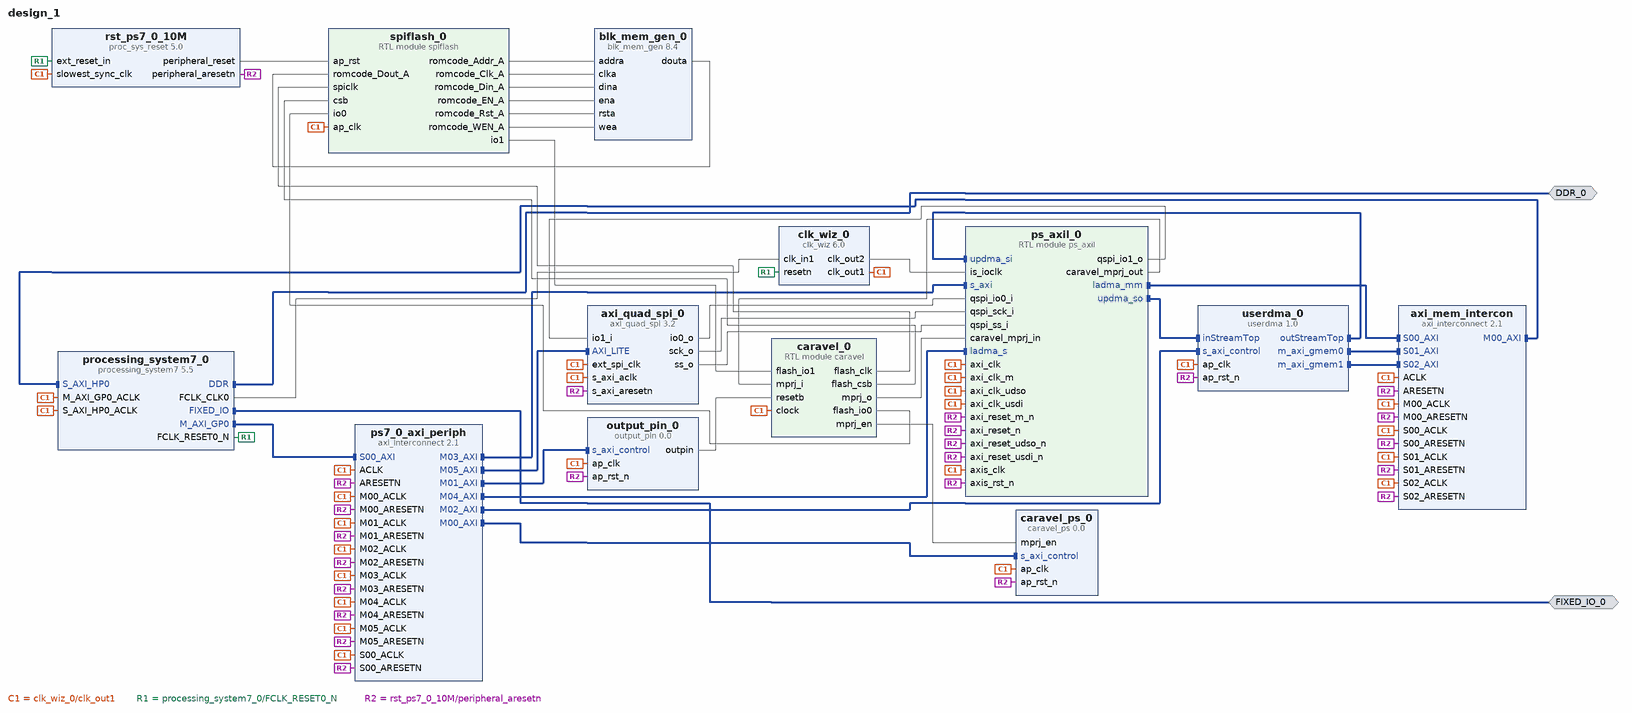
[diagram p0: block diagram of the top level]
# Vivado block design design_1, xc7z020clg400-1, Vivado 2022.1
create_bd_design design_1

create_bd_intf_port -mode Master -vlnv xilinx.com:interface:ddrx_rtl:1.0 DDR_0
create_bd_intf_port -mode Master -vlnv xilinx.com:display_processing_system7:fixedio_rtl:1.0 FIXED_IO_0

create_bd_cell -type ip -vlnv xilinx.com:ip:axi_interconnect:2.1 axi_mem_intercon
set_property -dict {CONFIG.NUM_MI 1 CONFIG.NUM_SI 3} [get_bd_cells axi_mem_intercon]
create_bd_cell -type ip -vlnv xilinx.com:ip:axi_quad_spi:3.2 axi_quad_spi_0
set_property -dict {CONFIG.C_SCK_RATIO 8 CONFIG.C_USE_STARTUP 0} [get_bd_cells axi_quad_spi_0]
create_bd_cell -type ip -vlnv xilinx.com:ip:blk_mem_gen:8.4 blk_mem_gen_0
set_property -dict [list \
  CONFIG.Enable_B Use_ENB_Pin \
  CONFIG.Memory_Type True_Dual_Port_RAM \
  CONFIG.Port_B_Clock 100 \
  CONFIG.Port_B_Enable_Rate 100 \
  CONFIG.Port_B_Write_Rate 50 \
  CONFIG.Use_RSTB_Pin true \
] [get_bd_cells blk_mem_gen_0]
create_bd_cell -type ip -vlnv xilinx.com:hls:caravel_ps:0.0 caravel_ps_0
create_bd_cell -type ip -vlnv xilinx.com:ip:clk_wiz:6.0 clk_wiz_0
set_property -dict [list \
  CONFIG.CLKIN1_JITTER_PS 40.0 \
  CONFIG.CLKOUT1_JITTER 925.151 \
  CONFIG.CLKOUT1_PHASE_ERROR 919.522 \
  CONFIG.CLKOUT1_REQUESTED_OUT_FREQ 5 \
  CONFIG.CLKOUT2_JITTER 761.006 \
  CONFIG.CLKOUT2_PHASE_ERROR 919.522 \
  CONFIG.CLKOUT2_REQUESTED_OUT_FREQ 20 \
  CONFIG.CLKOUT2_USED true \
  CONFIG.MMCM_CLKFBOUT_MULT_F 64.000 \
  CONFIG.MMCM_CLKIN1_PERIOD 4.000 \
  CONFIG.MMCM_CLKIN2_PERIOD 10.0 \
  CONFIG.MMCM_CLKOUT0_DIVIDE_F 128.000 \
  CONFIG.MMCM_CLKOUT1_DIVIDE 32 \
  CONFIG.MMCM_DIVCLK_DIVIDE 25 \
  CONFIG.NUM_OUT_CLKS 2 \
  CONFIG.RESET_PORT resetn \
  CONFIG.RESET_TYPE ACTIVE_LOW \
] [get_bd_cells clk_wiz_0]
create_bd_cell -type ip -vlnv xilinx.com:hls:output_pin:0.0 output_pin_0
create_bd_cell -type ip -vlnv xilinx.com:ip:processing_system7:5.5 processing_system7_0
set_property -dict [list \
  CONFIG.PCW_APU_PERIPHERAL_FREQMHZ 650 \
  CONFIG.PCW_CRYSTAL_PERIPHERAL_FREQMHZ 50 \
  CONFIG.PCW_ENET0_ENET0_IO {MIO 16 .. 27} \
  CONFIG.PCW_ENET0_GRP_MDIO_ENABLE 1 \
  CONFIG.PCW_ENET0_GRP_MDIO_IO {MIO 52 .. 53} \
  CONFIG.PCW_ENET0_PERIPHERAL_ENABLE 1 \
  CONFIG.PCW_ENET0_RESET_ENABLE 1 \
  CONFIG.PCW_ENET0_RESET_IO {MIO 9} \
  CONFIG.PCW_ENET_RESET_ENABLE 1 \
  CONFIG.PCW_ENET_RESET_SELECT {Share reset pin} \
  CONFIG.PCW_FPGA0_PERIPHERAL_FREQMHZ 250 \
  CONFIG.PCW_FPGA1_PERIPHERAL_FREQMHZ 50 \
  CONFIG.PCW_GPIO_MIO_GPIO_ENABLE 1 \
  CONFIG.PCW_GPIO_MIO_GPIO_IO MIO \
  CONFIG.PCW_I2C_RESET_ENABLE 0 \
  CONFIG.PCW_PERIPHERAL_BOARD_PRESET part0 \
  CONFIG.PCW_PRESET_BANK1_VOLTAGE {LVCMOS 1.8V} \
  CONFIG.PCW_QSPI_GRP_FBCLK_ENABLE 1 \
  CONFIG.PCW_QSPI_GRP_FBCLK_IO {MIO 8} \
  CONFIG.PCW_QSPI_GRP_SINGLE_SS_ENABLE 1 \
  CONFIG.PCW_QSPI_GRP_SINGLE_SS_IO {MIO 1 .. 6} \
  CONFIG.PCW_QSPI_PERIPHERAL_ENABLE 1 \
  CONFIG.PCW_QSPI_QSPI_IO {MIO 1 .. 6} \
  CONFIG.PCW_SD0_GRP_CD_ENABLE 1 \
  CONFIG.PCW_SD0_GRP_CD_IO {MIO 47} \
  CONFIG.PCW_SD0_GRP_WP_ENABLE 0 \
  CONFIG.PCW_SD0_PERIPHERAL_ENABLE 1 \
  CONFIG.PCW_SD0_SD0_IO {MIO 40 .. 45} \
  CONFIG.PCW_SDIO_PERIPHERAL_FREQMHZ 50 \
  CONFIG.PCW_SINGLE_QSPI_DATA_MODE x4 \
  CONFIG.PCW_UART0_PERIPHERAL_ENABLE 1 \
  CONFIG.PCW_UART0_UART0_IO {MIO 14 .. 15} \
  CONFIG.PCW_UART1_PERIPHERAL_ENABLE 0 \
  CONFIG.PCW_UART_PERIPHERAL_FREQMHZ 100 \
  CONFIG.PCW_UIPARAM_DDR_BUS_WIDTH {16 Bit} \
  CONFIG.PCW_UIPARAM_DDR_FREQ_MHZ 525 \
  CONFIG.PCW_UIPARAM_DDR_PARTNO {MT41J256M16 RE-125} \
  CONFIG.PCW_USB0_PERIPHERAL_ENABLE 1 \
  CONFIG.PCW_USB0_RESET_ENABLE 1 \
  CONFIG.PCW_USB0_RESET_IO {MIO 46} \
  CONFIG.PCW_USB0_USB0_IO {MIO 28 .. 39} \
  CONFIG.PCW_USB_RESET_ENABLE 1 \
  CONFIG.PCW_USB_RESET_SELECT {Share reset pin} \
  CONFIG.PCW_USE_S_AXI_HP0 1 \
] [get_bd_cells processing_system7_0]
# 492 more settings of processing_system7_0 are not shown: defaults, MIO pin electricals, DDR timing, and values the tool derives
create_bd_cell -type ip -vlnv xilinx.com:ip:axi_interconnect:2.1 ps7_0_axi_periph
set_property -dict {CONFIG.NUM_MI 6} [get_bd_cells ps7_0_axi_periph]
create_bd_cell -type ip -vlnv xilinx.com:ip:proc_sys_reset:5.0 rst_ps7_0_10M
create_bd_cell -type module -reference spiflash spiflash_0
create_bd_cell -type ip -vlnv xilinx.com:hls:userdma:1.0 userdma_0
create_bd_cell -type module -reference caravel caravel_0
create_bd_cell -type module -reference ps_axil ps_axil_0

# ---- connections ----

connect_bd_intf_net [get_bd_intf_pins axi_mem_intercon/M00_AXI] [get_bd_intf_pins processing_system7_0/S_AXI_HP0]
connect_bd_intf_net [get_bd_intf_ports DDR_0] [get_bd_intf_pins processing_system7_0/DDR]
connect_bd_intf_net [get_bd_intf_ports FIXED_IO_0] [get_bd_intf_pins processing_system7_0/FIXED_IO]
connect_bd_intf_net [get_bd_intf_pins processing_system7_0/M_AXI_GP0] [get_bd_intf_pins ps7_0_axi_periph/S00_AXI]
connect_bd_intf_net [get_bd_intf_pins caravel_ps_0/s_axi_control] [get_bd_intf_pins ps7_0_axi_periph/M00_AXI]
connect_bd_intf_net [get_bd_intf_pins output_pin_0/s_axi_control] [get_bd_intf_pins ps7_0_axi_periph/M01_AXI]
connect_bd_intf_net [get_bd_intf_pins ps7_0_axi_periph/M02_AXI] [get_bd_intf_pins userdma_0/s_axi_control]
connect_bd_intf_net [get_bd_intf_pins ps7_0_axi_periph/M03_AXI] [get_bd_intf_pins ps_axil_0/s_axi]
connect_bd_intf_net [get_bd_intf_pins ps7_0_axi_periph/M04_AXI] [get_bd_intf_pins ps_axil_0/ladma_s]
connect_bd_intf_net [get_bd_intf_pins axi_quad_spi_0/AXI_LITE] [get_bd_intf_pins ps7_0_axi_periph/M05_AXI]
connect_bd_intf_net [get_bd_intf_pins axi_mem_intercon/S00_AXI] [get_bd_intf_pins ps_axil_0/ladma_mm]
connect_bd_intf_net [get_bd_intf_pins userdma_0/inStreamTop] [get_bd_intf_pins ps_axil_0/updma_so]
connect_bd_intf_net [get_bd_intf_pins userdma_0/m_axi_gmem0] [get_bd_intf_pins axi_mem_intercon/S01_AXI]
connect_bd_intf_net [get_bd_intf_pins userdma_0/m_axi_gmem1] [get_bd_intf_pins axi_mem_intercon/S02_AXI]
connect_bd_intf_net [get_bd_intf_pins ps_axil_0/updma_si] [get_bd_intf_pins userdma_0/outStreamTop]
connect_bd_net [get_bd_pins axi_quad_spi_0/io0_o] [get_bd_pins ps_axil_0/qspi_io0_i]
connect_bd_net [get_bd_pins axi_quad_spi_0/sck_o] [get_bd_pins ps_axil_0/qspi_sck_i]
connect_bd_net [get_bd_pins axi_quad_spi_0/ss_o] [get_bd_pins ps_axil_0/qspi_ss_i]
connect_bd_net [get_bd_pins blk_mem_gen_0/douta] [get_bd_pins spiflash_0/romcode_Dout_A]
connect_bd_net [get_bd_pins caravel_0/flash_clk] [get_bd_pins spiflash_0/spiclk]
connect_bd_net [get_bd_pins caravel_0/flash_csb] [get_bd_pins spiflash_0/csb]
connect_bd_net [get_bd_pins caravel_0/flash_io0] [get_bd_pins spiflash_0/io0]
connect_bd_net [get_bd_pins caravel_0/mprj_en] [get_bd_pins caravel_ps_0/mprj_en]
connect_bd_net [get_bd_pins caravel_0/mprj_o] [get_bd_pins ps_axil_0/caravel_mprj_in]
connect_bd_net [get_bd_pins clk_wiz_0/clk_out1] \
  [get_bd_pins axi_mem_intercon/ACLK] [get_bd_pins axi_mem_intercon/M00_ACLK] [get_bd_pins axi_mem_intercon/S00_ACLK] \
  [get_bd_pins axi_quad_spi_0/ext_spi_clk] [get_bd_pins axi_quad_spi_0/s_axi_aclk] [get_bd_pins caravel_ps_0/ap_clk] \
  [get_bd_pins output_pin_0/ap_clk] [get_bd_pins processing_system7_0/M_AXI_GP0_ACLK] \
  [get_bd_pins processing_system7_0/S_AXI_HP0_ACLK] [get_bd_pins ps7_0_axi_periph/ACLK] \
  [get_bd_pins ps7_0_axi_periph/M00_ACLK] [get_bd_pins ps7_0_axi_periph/M01_ACLK] [get_bd_pins ps7_0_axi_periph/M02_ACLK] \
  [get_bd_pins ps7_0_axi_periph/M03_ACLK] [get_bd_pins ps7_0_axi_periph/M04_ACLK] [get_bd_pins ps7_0_axi_periph/M05_ACLK] \
  [get_bd_pins ps7_0_axi_periph/S00_ACLK] [get_bd_pins rst_ps7_0_10M/slowest_sync_clk] [get_bd_pins spiflash_0/ap_clk] \
  [get_bd_pins userdma_0/ap_clk] [get_bd_pins axi_mem_intercon/S01_ACLK] [get_bd_pins axi_mem_intercon/S02_ACLK] \
  [get_bd_pins caravel_0/clock] [get_bd_pins ps_axil_0/axi_clk] [get_bd_pins ps_axil_0/axi_clk_m] \
  [get_bd_pins ps_axil_0/axi_clk_usdi] [get_bd_pins ps_axil_0/axi_clk_udso] [get_bd_pins ps_axil_0/axis_clk]
connect_bd_net [get_bd_pins clk_wiz_0/clk_out2] [get_bd_pins ps_axil_0/is_ioclk]
connect_bd_net [get_bd_pins output_pin_0/outpin] [get_bd_pins caravel_0/resetb]
connect_bd_net [get_bd_pins processing_system7_0/FCLK_CLK0] [get_bd_pins clk_wiz_0/clk_in1]
connect_bd_net [get_bd_pins processing_system7_0/FCLK_RESET0_N] [get_bd_pins clk_wiz_0/resetn] [get_bd_pins rst_ps7_0_10M/ext_reset_in]
connect_bd_net [get_bd_pins ps_axil_0/caravel_mprj_out] [get_bd_pins caravel_0/mprj_i]
connect_bd_net [get_bd_pins ps_axil_0/qspi_io1_o] [get_bd_pins axi_quad_spi_0/io1_i]
connect_bd_net -net rst_ps7_0_100M_peripheral_aresetn [get_bd_pins rst_ps7_0_10M/peripheral_aresetn] \
  [get_bd_pins axi_mem_intercon/ARESETN] [get_bd_pins axi_mem_intercon/M00_ARESETN] \
  [get_bd_pins axi_mem_intercon/S00_ARESETN] [get_bd_pins axi_quad_spi_0/s_axi_aresetn] [get_bd_pins caravel_ps_0/ap_rst_n] \
  [get_bd_pins output_pin_0/ap_rst_n] [get_bd_pins ps7_0_axi_periph/ARESETN] [get_bd_pins ps7_0_axi_periph/M00_ARESETN] \
  [get_bd_pins ps7_0_axi_periph/M01_ARESETN] [get_bd_pins ps7_0_axi_periph/M02_ARESETN] \
  [get_bd_pins ps7_0_axi_periph/M03_ARESETN] [get_bd_pins ps7_0_axi_periph/M04_ARESETN] \
  [get_bd_pins ps7_0_axi_periph/M05_ARESETN] [get_bd_pins ps7_0_axi_periph/S00_ARESETN] [get_bd_pins userdma_0/ap_rst_n] \
  [get_bd_pins axi_mem_intercon/S01_ARESETN] [get_bd_pins axi_mem_intercon/S02_ARESETN] [get_bd_pins ps_axil_0/axi_reset_n] \
  [get_bd_pins ps_axil_0/axi_reset_m_n] [get_bd_pins ps_axil_0/axi_reset_usdi_n] [get_bd_pins ps_axil_0/axi_reset_udso_n] \
  [get_bd_pins ps_axil_0/axis_rst_n]
connect_bd_net -net rst_ps7_0_50M_peripheral_reset [get_bd_pins rst_ps7_0_10M/peripheral_reset] [get_bd_pins spiflash_0/ap_rst]
connect_bd_net [get_bd_pins spiflash_0/io1] [get_bd_pins caravel_0/flash_io1]
connect_bd_net [get_bd_pins spiflash_0/romcode_Addr_A] [get_bd_pins blk_mem_gen_0/addra]
connect_bd_net [get_bd_pins spiflash_0/romcode_Clk_A] [get_bd_pins blk_mem_gen_0/clka]
connect_bd_net [get_bd_pins spiflash_0/romcode_Din_A] [get_bd_pins blk_mem_gen_0/dina]
connect_bd_net [get_bd_pins spiflash_0/romcode_EN_A] [get_bd_pins blk_mem_gen_0/ena]
connect_bd_net [get_bd_pins spiflash_0/romcode_Rst_A] [get_bd_pins blk_mem_gen_0/rsta]
connect_bd_net [get_bd_pins spiflash_0/romcode_WEN_A] [get_bd_pins blk_mem_gen_0/wea]

# ---- address map ----
assign_bd_address -offset 0x40000000 -range 64K -target_address_space [get_bd_addr_spaces processing_system7_0/Data] [get_bd_addr_segs caravel_ps_0/s_axi_control/Reg]
assign_bd_address -offset 0x40010000 -range 64K -target_address_space [get_bd_addr_spaces processing_system7_0/Data] [get_bd_addr_segs output_pin_0/s_axi_control/Reg]
assign_bd_address -offset 0x44A00000 -range 64K -target_address_space [get_bd_addr_spaces processing_system7_0/Data] [get_bd_addr_segs axi_quad_spi_0/AXI_LITE/Reg]
assign_bd_address -offset 0x60000000 -range 32K -target_address_space [get_bd_addr_spaces processing_system7_0/Data] [get_bd_addr_segs ps_axil_0/s_axi/reg0]
assign_bd_address -offset 0x60008000 -range 4K -target_address_space [get_bd_addr_spaces processing_system7_0/Data] [get_bd_addr_segs ps_axil_0/ladma_s/reg0]
assign_bd_address -offset 0x60009000 -range 4K -target_address_space [get_bd_addr_spaces processing_system7_0/Data] [get_bd_addr_segs userdma_0/s_axi_control/Reg]
assign_bd_address -offset 0x0000000000000000 -range 512M -target_address_space [get_bd_addr_spaces ps_axil_0/ladma_mm] [get_bd_addr_segs processing_system7_0/S_AXI_HP0/HP0_DDR_LOWOCM]
assign_bd_address -offset 0x0000000000000000 -range 512M -target_address_space [get_bd_addr_spaces userdma_0/Data_m_axi_gmem0] [get_bd_addr_segs processing_system7_0/S_AXI_HP0/HP0_DDR_LOWOCM]
assign_bd_address -offset 0x0000000000000000 -range 512M -target_address_space [get_bd_addr_spaces userdma_0/Data_m_axi_gmem1] [get_bd_addr_segs processing_system7_0/S_AXI_HP0/HP0_DDR_LOWOCM]

validate_bd_design
save_bd_design
